# Altium project PCB_Project.PrjPcb
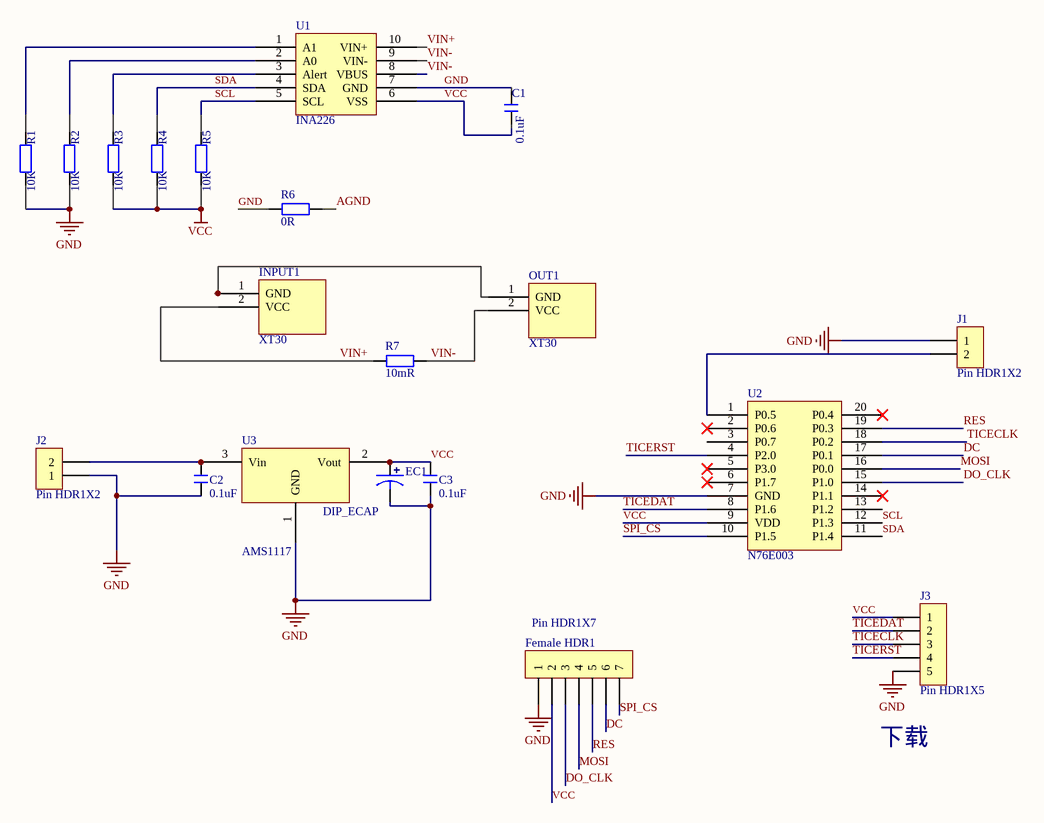
[diagram p0: Sheet1.SchDoc]
1 sheet, 20 parts. Net scope: global (net labels, ports and power ports of the same name join across sheets).
Board file: ina226.PcbDoc

## Sheet Sheet1.SchDoc
size A4

### Parts
C1  0.1uF  [C 0603_L]
C2  0.1uF  [0805C]
C3  0.1uF  [0805C]
EC1  DIP_ECAP  [DIP-EC2.5X6.3X11.2]
Female_HDR1  Pin HDR1X7  [Pin HDR1X7/2.54mm-S]
INPUT1  XT30  [XT30]
J1  Pin HDR1X2  [Pin HDR1X2/2.54mm-S]
J2  Pin HDR1X2  [Pin HDR1X2/2.54mm-S]
J3  Pin HDR1X5  [Pin HDR1X5/2.54mm-S]
OUT1  XT30  [XT30]
R1  10K  [R 0603_L]
R2  10K  [R 0603_L]
R3  10K  [R 0603_L]
R4  10K  [R 0603_L]
R5  10K  [R 0603_L]
R6  0R  [R 0805_L]
R7  10mR  [R 2512_L]
U1  INA226  [MSOP-10]
U2  N76E003  [N76E003-20N]
U3  AMS1117  [SOT223]

### Nets
GND: C1.2 C2.2 C3.2 EC1.2 Female_HDR1.1 J1.1 J2.1 J3.5 R1.1 R2.1 R6.2 U1.7(GND) U2.7(GND) U3.1(GND)
VCC: C1.1 C3.1 EC1.1 Female_HDR1.2 J3.1 R3.1 R4.1 R5.1 U1.6(VSS) U2.9(VDD) U3.2(Vout)
AGND: R6.1
DC: Female_HDR1.6 U2.17(P0.1)
DO_CLK: Female_HDR1.3 U2.15(P1.0)
MOSI: Female_HDR1.4 U2.16(P0.0)
RES: Female_HDR1.5 U2.19(P0.3)
SCL: R5.2 U1.5(SCL) U2.12(P1.3)
SDA: R4.2 U1.4(SDA) U2.11(P1.4)
SPI_CS: Female_HDR1.7 U2.10(P1.5)
TICECLK: J3.3 U2.18(P0.2)
TICEDAT: J3.2 U2.8(P1.6)
TICERST: J3.4 U2.4(P2.0)
VIN+: INPUT1.2(VCC) R7.1 U1.10(VIN+)
VIN-: OUT1.2(VCC) R7.2 U1.8(VBUS) U1.9(VIN-)
NetC2_1: C2.1 J2.2 U3.3(Vin)
NetINPUT1_1: INPUT1.1(GND) OUT1.1(GND)
NetJ1_2: J1.2 U2.1(P0.5)
NetR1_2: R1.2 U1.1(A1)
NetR2_2: R2.2 U1.2(A0)
NetR3_2: R3.2 U1.3(Alert)

Not connected (* = marked no-connect by the designer): U2 2(P0.6)* 3(P0.7) 5(P3.0)* 6(P1.7)* 13(P1.2) 14(P1.1)* 20(P0.4)*

### Notes on the sheet
- 下载

### Library data of the parts
C1-C3 = C: 贴片电容; BOM名称: 无极性贴片电容; 淘宝ID: 封装库来自淘宝 ID：黄晶宝石; 联系售后: https://shop463601444.taobao.com
EC1 = DIP_ECAP: 直插电解电容
R1-R7 = R: 贴片电阻; 版权归属: 来自淘宝 ID：黄晶宝石; BOM名称: 贴片电阻; 联系售后: https://shop463601444.taobao.com
U3 = AMS1117: 三端稳压芯片